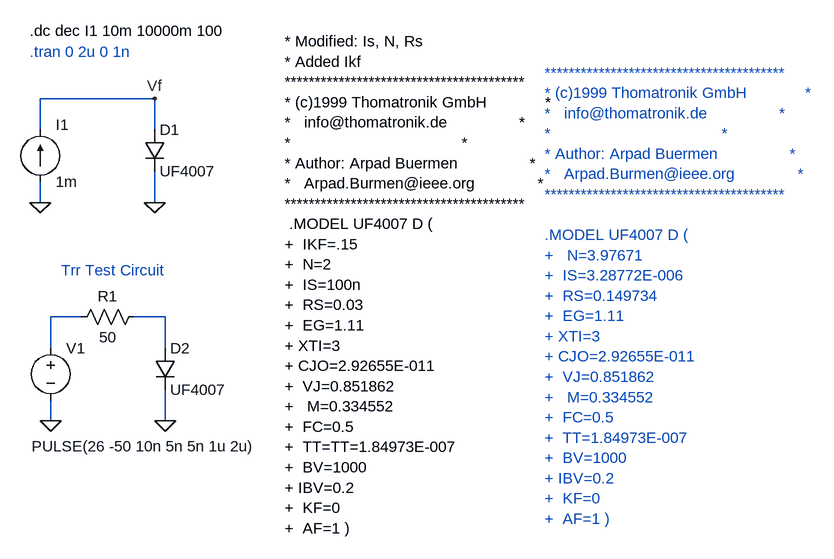
[diagram p0: schematic UF4007_Is_N_Ikf.asc]
UF4007_Is_N_Ikf.asc, the LTspice schematic file:
Version 4
SHEET 1 1692 1024
WIRE 272 96 96 96
WIRE 96 144 96 96
WIRE 272 144 272 96
WIRE 96 256 96 224
WIRE 272 256 272 208
WIRE 160 432 112 432
WIRE 288 432 240 432
WIRE 112 480 112 432
WIRE 288 480 288 432
WIRE 112 592 112 560
WIRE 288 592 288 544
FLAG 272 256 0
FLAG 96 256 0
FLAG 272 96 Vf
FLAG 288 592 0
FLAG 112 592 0
SYMBOL diode 256 144 R0
SYMATTR InstName D1
SYMATTR Value UF4007
SYMBOL current 96 224 M180
WINDOW 0 24 88 Left 0
WINDOW 3 24 0 Left 0
SYMATTR InstName I1
SYMATTR Value 1m
SYMBOL diode 272 480 R0
SYMATTR InstName D2
SYMATTR Value UF4007
SYMBOL res 144 448 R270
WINDOW 0 32 56 VTop 0
WINDOW 3 0 56 VBottom 0
SYMATTR InstName R1
SYMATTR Value 50
SYMBOL voltage 112 464 R0
WINDOW 3 -29 167 Left 0
WINDOW 123 0 0 Left 0
WINDOW 39 24 132 Left 0
SYMATTR InstName V1
SYMATTR Value PULSE(26 -50 10n 5n 5n 1u 2u)
TEXT 80 -8 Left 0 !.dc dec I1 10m 10000m 100
TEXT 472 8 Left 0 !* Modified: Is, N, Rs\n* Added Ikf\n****************************************\n* (c)1999 Thomatronik GmbH             *\n*   info@thomatronik.de                *\n*                                      *\n* Author: Arpad Buermen                *\n*   Arpad.Burmen@ieee.org              *\n****************************************\n .MODEL UF4007 D (\n+  IKF=.15\n+  N=2\n+  IS=100n\n+  RS=0.03\n+  EG=1.11\n+ XTI=3\n+ CJO=2.92655E-011\n+  VJ=0.851862\n+   M=0.334552\n+  FC=0.5\n+  TT=TT=1.84973E-007\n+  BV=1000\n+ IBV=0.2\n+  KF=0\n+  AF=1 )
TEXT 872 56 Left 0 ;****************************************\n* (c)1999 Thomatronik GmbH             *\n*   info@thomatronik.de                *\n*                                      *\n* Author: Arpad Buermen                *\n*   Arpad.Burmen@ieee.org              *\n****************************************\n \n.MODEL UF4007 D (\n+   N=3.97671\n+  IS=3.28772E-006\n+  RS=0.149734\n+  EG=1.11\n+ XTI=3\n+ CJO=2.92655E-011\n+  VJ=0.851862\n+   M=0.334552\n+  FC=0.5\n+  TT=1.84973E-007\n+  BV=1000\n+ IBV=0.2\n+  KF=0\n+  AF=1 )
TEXT 80 24 Left 0 ;.tran 0 2u 0 1n
TEXT 128 360 Left 0 ;Trr Test Circuit

The netlist it stands for:
* UF4007_Is_N_Ikf.asc
D1 Vf 0 UF4007
I1 0 Vf 1m
D2 N002 0 UF4007
R1 N001 N002 50
V1 N001 0 PULSE(26 -50 10n 5n 5n 1u 2u)
.model D D
.lib standard.dio
.dc dec I1 10m 10000m 100
* Modified: Is, N, Rs
* Added Ikf
****************************************
* (c)1999 Thomatronik GmbH             *
*   info@thomatronik.de                *
*                                      *
* Author: Arpad Buermen                *
*   Arpad.Burmen@ieee.org              *
****************************************
 .MODEL UF4007 D (
+  IKF=.15
+  N=2
+  IS=100n
+  RS=0.03
+  EG=1.11
+ XTI=3
+ CJO=2.92655E-011
+  VJ=0.851862
+   M=0.334552
+  FC=0.5
+  TT=TT=1.84973E-007
+  BV=1000
+ IBV=0.2
+  KF=0
+  AF=1 )
* ****************************************
* * (c)1999 Thomatronik GmbH             *
* *   info@thomatronik.de                *
* *                                      *
* * Author: Arpad Buermen                *
* *   Arpad.Burmen@ieee.org              *
* ****************************************
* .MODEL UF4007 D (
* +   N=3.97671
* +  IS=3.28772E-006
* +  RS=0.149734
* +  EG=1.11
* + XTI=3
* + CJO=2.92655E-011
* +  VJ=0.851862
* +   M=0.334552
* +  FC=0.5
* +  TT=1.84973E-007
* +  BV=1000
* + IBV=0.2
* +  KF=0
* +  AF=1 )
* .tran 0 2u 0 1n
* Trr Test Circuit
.backanno
.end